# EAGLE design circuit (EAGLE 9.6.2)
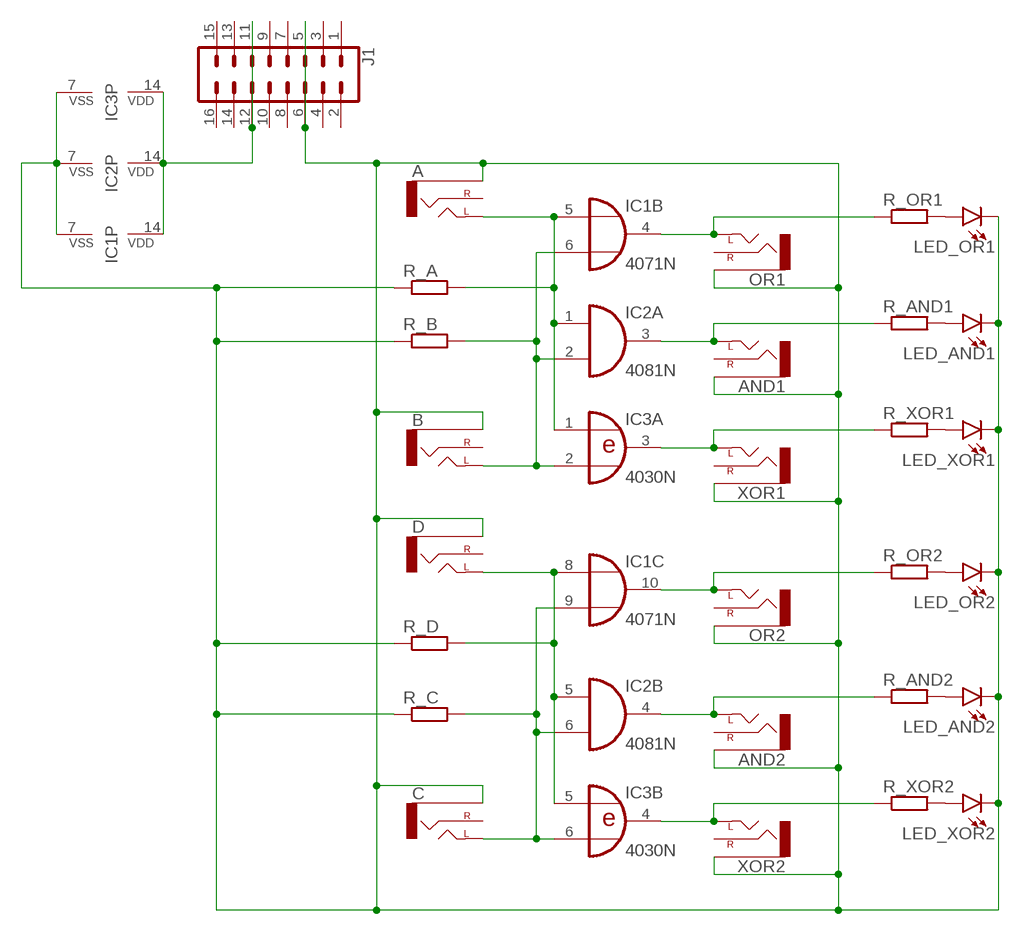
[diagram p0: schematic, sheet 1]

## Parts
A  THONKI-STEREO  [WQP-PJ366ST_JACK]
AND1  THONKI-STEREO  [WQP-PJ366ST_JACK]
AND2  THONKI-STEREO  [WQP-PJ366ST_JACK]
B  THONKI-STEREO  [WQP-PJ366ST_JACK]
C  THONKI-STEREO  [WQP-PJ366ST_JACK]
D  THONKI-STEREO  [WQP-PJ366ST_JACK]
IC1  4071N  [DIL14]
IC2  4081N  [DIL14]
IC3  4030N  [DIL14]
J1  CONN_08X2  [2X8]
LED_AND1  LED3MM  [LED_3MM]
LED_AND2  LED3MM  [LED_3MM]
LED_OR1  LED3MM  [LED_3MM]
LED_OR2  LED3MM  [LED_3MM]
LED_XOR1  LED3MM  [LED_3MM]
LED_XOR2  LED3MM  [LED_3MM]
OR1  THONKI-STEREO  [WQP-PJ366ST_JACK]
OR2  THONKI-STEREO  [WQP-PJ366ST_JACK]
R_A  RESISTOR7MM  [7MM_RESISTOR]
R_AND1  RESISTOR7MM  [7MM_RESISTOR]
R_AND2  RESISTOR7MM  [7MM_RESISTOR]
R_B  RESISTOR7MM  [7MM_RESISTOR]
R_C  RESISTOR7MM  [7MM_RESISTOR]
R_D  RESISTOR7MM  [7MM_RESISTOR]
R_OR1  RESISTOR7MM  [7MM_RESISTOR]
R_OR2  RESISTOR7MM  [7MM_RESISTOR]
R_XOR1  RESISTOR7MM  [7MM_RESISTOR]
R_XOR2  RESISTOR7MM  [7MM_RESISTOR]
XOR1  THONKI-STEREO  [WQP-PJ366ST_JACK]
XOR2  THONKI-STEREO  [WQP-PJ366ST_JACK]

## Nets
LED_OR1: A.P$3_SLEEVE(SLEEVE) AND1.P$3_SLEEVE(SLEEVE) AND2.P$3_SLEEVE(SLEEVE) B.P$3_SLEEVE(SLEEVE) C.P$3_SLEEVE(SLEEVE) D.P$3_SLEEVE(SLEEVE) IC1.7(P:VSS) IC2.7(P:VSS) IC3.7(P:VSS) J1.5 J1.6 LED_AND1.K(C) LED_AND2.K(C) LED_OR1.K(C) LED_OR2.K(C) LED_XOR1.K(C) LED_XOR2.K(C) OR1.P$3_SLEEVE(SLEEVE) OR2.P$3_SLEEVE(SLEEVE) R_A.1 R_B.1 R_C.1 R_D.1 XOR1.P$3_SLEEVE(SLEEVE) XOR2.P$3_SLEEVE(SLEEVE)
N$2: LED_OR1.A R_OR1.2
N$8: LED_AND1.A R_AND1.2
N$9: IC1.14(P:VDD) IC2.14(P:VDD) IC3.14(P:VDD) J1.11 J1.12
N$10: LED_XOR1.A R_XOR1.2
N$11: LED_OR2.A R_OR2.2
N$12: LED_AND2.A R_AND2.2
N$13: LED_XOR2.A R_XOR2.2
N$14: IC3.4(B:O) R_XOR2.1 XOR2.P$1_TIP(LEFT)
N$16: AND2.P$1_TIP(LEFT) IC2.4(B:O) R_AND2.1
N$18: IC1.10(C:O) OR2.P$1_TIP(LEFT) R_OR2.1
N$19: IC3.3(A:O) R_XOR1.1 XOR1.P$1_TIP(LEFT)
N$20: AND1.P$1_TIP(LEFT) IC2.3(A:O) R_AND1.1
N$21: IC1.4(B:O) OR1.P$1_TIP(LEFT) R_OR1.1
N$22: A.P$1_TIP(LEFT) IC1.5(B:I0) IC2.1(A:I0) IC3.1(A:I0) R_A.2
N$23: B.P$1_TIP(LEFT) IC1.6(B:I1) IC2.2(A:I1) IC3.2(A:I1) R_B.2
N$26: D.P$1_TIP(LEFT) IC1.8(C:I0) IC2.5(B:I0) IC3.5(B:I0) R_D.2
N$27: C.P$1_TIP(LEFT) IC1.9(C:I1) IC2.6(B:I1) IC3.6(B:I1) R_C.2
Unconnected: A.P$2_SWITCH(RIGHT) AND1.P$2_SWITCH(RIGHT) AND2.P$2_SWITCH(RIGHT) B.P$2_SWITCH(RIGHT) C.P$2_SWITCH(RIGHT) D.P$2_SWITCH(RIGHT) IC1.1(A:I0) IC1.2(A:I1) IC1.3(A:O) IC1.11(D:O) IC1.12(D:I0) IC1.13(D:I1) IC2.8(C:I0) IC2.9(C:I1) IC2.10(C:O) IC2.11(D:O) IC2.12(D:I0) IC2.13(D:I1) IC3.8(C:I0) IC3.9(C:I1) IC3.10(C:O) IC3.11(D:O) IC3.12(D:I0) IC3.13(D:I1) J1.1 J1.2 J1.3 J1.4 J1.7 J1.8 J1.9 J1.10 J1.13 J1.14 J1.15 J1.16 OR1.P$2_SWITCH(RIGHT) OR2.P$2_SWITCH(RIGHT) XOR1.P$2_SWITCH(RIGHT) XOR2.P$2_SWITCH(RIGHT)

## Library data of the parts
A AND1 AND2 B C D OR1 OR2 XOR1 XOR2 = MusicThingModular:THONKI-STEREO: 3.5mm socket for Eurorack modular synths
IC1 = 40xx:4071: Quad 2-input OR
IC2 = 40xx:4081: Quad 2-input AND
IC3 = 40xx:4030: Quad XOR
J1 = SparkFun-Connectors:CONN_08X2: Multi connection point. Often used as Generic Header-pin footprint for 0.1 inch spaced/style header connections You can populate with any combo of single row headers, but if you'd like an exact match, check this: Header - 2x8 (Male, 0.1") <https://www.sparkfun.com/products/13156> (PRT-13156) On any of the 0.1 inch spaced packages, you can populate with these: Break Away Headers - Straight <https://www.sparkfun.com/products/116> (PRT-00116) Break Away Male Headers - Right Angle <https://www.sparkfun.com/products/553> (PRT-00553) Female Headers <https://www.sparkfun.com/products/115> (PRT-00115) Break Away Headers - Machine Pin <https://www.sparkfun.com/products/117> (PRT-00117) Break Away Female Headers - Swiss Machine Pin <https://www.sparkfun.com/products/743> (PRT-00743)
LED_AND1 LED_AND2 LED_OR1 LED_OR2 LED_XOR1 LED_XOR2 = SparkFun-LED:LED: LED (Generic) Standard schematic elements and footprints for 5mm, 3mm, 1206, and 0603 sized LEDs. Generic LEDs with no color specified.; PROD_ID: DIO-08794
R_A R_AND1 R_AND2 R_B R_C R_D R_OR1 R_OR2 R_XOR1 R_XOR2 = MusicThingModular:RESISTOR: Standard resistor, various versions

## Board
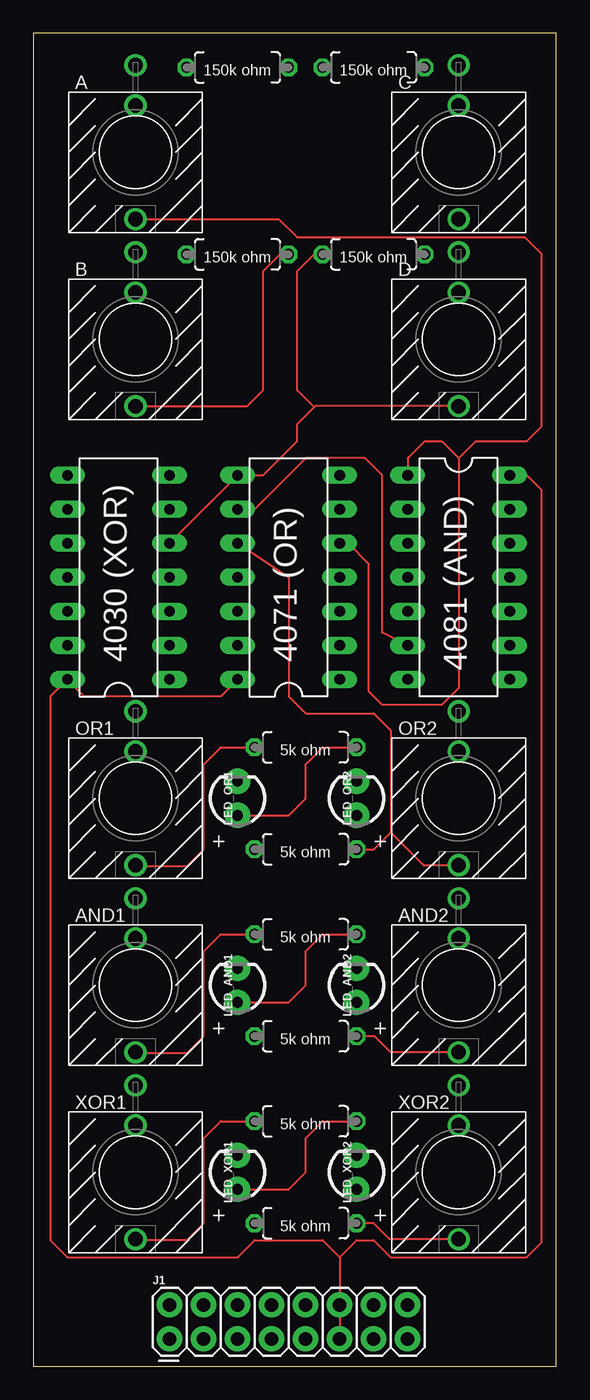
[diagram p1: board, top side]
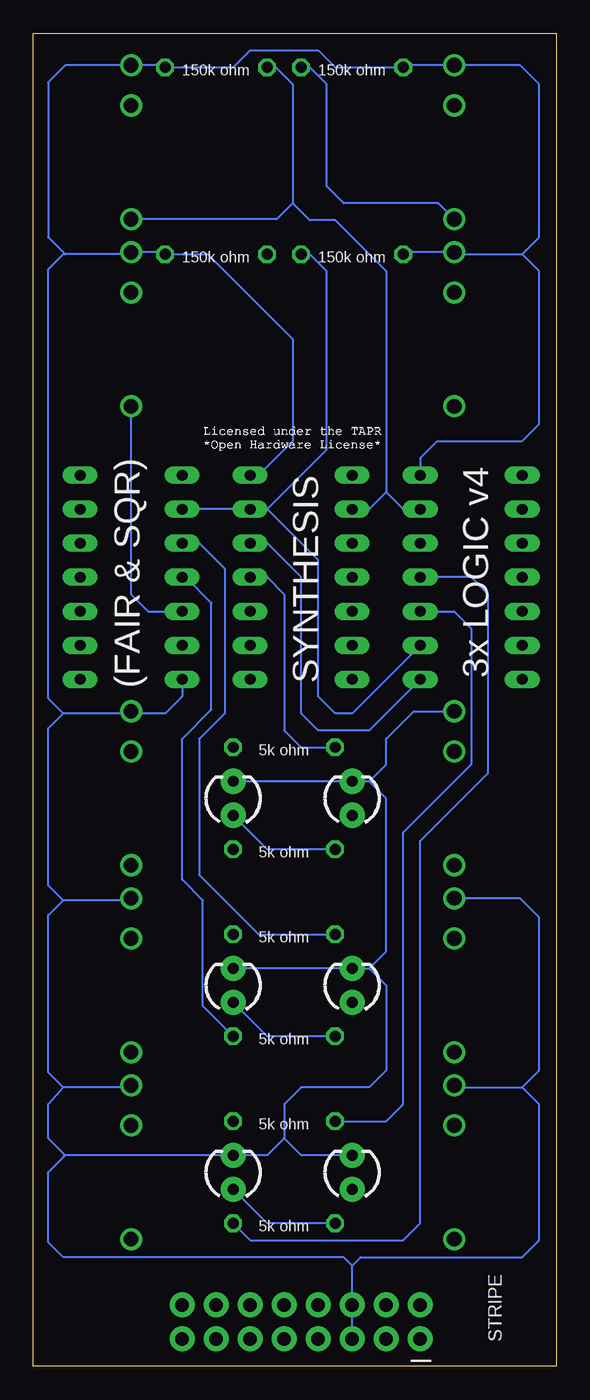
[diagram p2: board, bottom side, seen from below]

Size 39.04 x 99.56 mm. Coordinates in mm from the lower left corner, seen from the top.
Outline: 0,0 39.04,0 39.04,99.56 0,99.56 0,0
Copper layers (1*16): Top 0.035mm / dielectric 1.5mm / Bottom 0.035mm
Design rules "default": minimum track width 6mil, minimum drill 0.35mm, track to track 6mil, track to pad 6mil, pad to pad 6mil, via to via 6mil, smd to smd 6mil, copper to edge 40mil, drill to drill 6mil, minimum pad ring 10mil, minimum via ring 8mil, stop-mask expansion 4mil, vias tented up to drill 0mil, thermal gap 10mil

### Footprints (pad centres in the part's own frame; a part is rotated, then mirrored left to right if it is on the bottom)
WQP-PJ366ST_JACK = drill 1.1: P$1_TIP 0,5; P$2_SWITCH 0,-3.5; P$3_SLEEVE 0,-6.5
DIL14 = drill 0.813 long: 1 -7.62,-3.81; 2 -5.08,-3.81; 3 -2.54,-3.81; 4 0,-3.81; 5 2.54,-3.81; 6 5.08,-3.81; 7 7.62,-3.81; 8 7.62,3.81; 9 5.08,3.81; 10 2.54,3.81; 11 0,3.81; 12 -2.54,3.81; 13 -5.08,3.81; 14 -7.62,3.81
2X8 = drill 1.016 pad 1.88: 1 0,0; 2 0,2.54; 3 2.54,0; 4 2.54,2.54; 5 5.08,0; 6 5.08,2.54; 7 7.62,0; 8 7.62,2.54; 9 10.16,0; 10 10.16,2.54; 11 12.7,0; 12 12.7,2.54; 13 15.24,0; 14 15.24,2.54; 15 17.78,0; 16 17.78,2.54
LED_3MM = drill 0.813 pad 1.88: A -1.27,0; K 1.27,0
7MM_RESISTOR = drill 0.813 octagon: 1 -3.81,0; 2 3.81,0

### Placement (x,y rotation side)
A  7.62,90.68 180 top
AND1  7.62,28.45 180 top
AND2  31.75,28.45 180 top
B  7.62,76.71 180 top
C  31.75,90.68 180 top
D  31.75,76.71 180 top
IC1  19.05,58.93 90 top
IC2  31.75,58.93 270 top
IC3  6.35,58.93 90 top
J1  10.16,2.03 0 top
LED_AND1  15.24,28.45 90 top
LED_AND2  24.13,28.45 90 top
LED_OR1  15.24,42.42 90 top
LED_OR2  24.13,42.42 90 top
LED_XOR1  15.24,14.48 90 top
LED_XOR2  24.13,14.48 90 top
OR1  7.62,42.42 180 top
OR2  31.75,42.42 180 top
R_A  15.24,97.03 0 top
R_AND1  20.32,32.26 0 top
R_AND2  20.32,24.64 180 top
R_B  15.24,83.06 0 top
R_C  25.4,97.03 180 top
R_D  25.4,83.06 180 top
R_OR1  20.32,46.23 0 top
R_OR2  20.32,38.61 180 top
R_XOR1  20.32,18.29 0 top
R_XOR2  20.32,10.67 180 top
XOR1  7.62,14.48 180 top
XOR2  31.75,14.48 180 top

### Tracks (layer width: path | path; a pad name or v marks a point on that pad's centre or on a via)
LED_OR1
  Bottom 0.152: 2.54,83.06 7.47,83.06 B.P$3_SLEEVE 11.28,83.21 R_B.1 | 2.54,83.06 1.27,84.33 1.27,95.76 2.69,97.18 A.P$3_SLEEVE 11.28,97.18 R_A.1 16.51,97.03 17.78,98.3 22.86,98.3 24.13,97.03 R_C.1 29.36,97.18 C.P$3_SLEEVE 36.68,97.18 37.95,95.91 37.95,84.33 36.75,83.13 | XOR1.P$3_SLEEVE 7.47,20.83 2.54,20.83 | 2.54,20.83 1.27,22.1 1.27,33.53 2.69,34.95 AND1.P$3_SLEEVE | 2.54,83.06 1.27,81.79 1.27,70.36 2.54,69.09 8.89,69.09 10.16,67.82 IC3.7 | J1.5 J1.6 15.24,7.49 | LED_XOR1.K 19.05,15.75 20.32,17.02 | LED_AND2.K LED_AND1.K 13.97,29.72 | LED_OR2.K LED_OR1.K 13.97,43.69 | 36.83,48.77 37.95,49.89 37.95,81.94 36.75,83.13 | AND2.P$3_SLEEVE 31.9,34.8 36.83,34.8 | 36.83,34.8 37.95,35.92 37.95,47.65 36.83,48.77 | XOR2.P$3_SLEEVE 31.9,20.83 36.83,20.83 | 36.83,20.83 37.95,21.95 37.95,33.68 36.83,34.8 | 2.54,20.83 1.27,19.56 1.27,9.4 2.54,8.13 14.61,8.13 15.24,7.49 | 36.83,20.83 37.95,19.56 37.95,17.02 36.75,15.82 36.75,15.67 | IC2.7 27.94,50.04 29.21,48.77 31.75,48.77 | 31.75,48.77 36.83,48.77 | OR2.P$3_SLEEVE 31.75,48.77 | 13.97,29.72 12.7,28.45 12.7,22.1 13.97,20.83 19.05,20.83 20.32,19.56 20.32,17.02 | 20.32,17.02 21.59,15.75 LED_XOR2.K 36.68,15.75 36.75,15.67 | 13.97,29.72 12.7,30.99 12.7,42.42 13.97,43.69 | 13.97,43.69 12.7,44.96 12.7,46.86 10.64,48.92 OR1.P$3_SLEEVE | 15.24,7.49 15.88,8.13 36.83,8.13 37.95,9.25 37.95,14.48 36.75,15.67 | IC1.7 22.23,66.55 19.68,69.09 19.68,76.71 26.04,83.06 R_D.1 29.36,83.21 D.P$3_SLEEVE 31.9,83.06 36.68,83.06 36.75,83.13
N$2
  Top 0.152: LED_OR1.A 19.05,41.15 20.32,42.42 20.32,44.96 21.59,46.23 R_OR1.2
N$8
  Top 0.152: LED_AND1.A 19.05,27.18 20.32,28.45 20.32,30.99 21.59,32.26 R_AND1.2
N$9
  Top 0.152: IC2.14 36.83,66.55 37.95,65.43 37.95,9.25 36.83,8.13 26.67,8.13 25.4,9.4 24.13,9.4 22.86,8.13 | 22.86,8.13 J1.12 J1.11 | 22.86,8.13 21.59,9.4 16.51,9.4 15.24,8.13 2.54,8.13 1.27,9.4 1.27,50.04 IC3.14 3.81,50.04 13.97,50.04 IC1.14
N$10
  Top 0.152: LED_XOR1.A 19.05,13.21 20.32,14.48 20.32,17.02 21.59,18.29 R_XOR1.2
N$11
  Bottom 0.152: R_OR2.2 21.59,38.61 LED_OR2.A
N$12
  Bottom 0.152: R_AND2.2 21.59,24.64 LED_AND2.A
N$13
  Bottom 0.152: R_XOR2.2 21.59,10.67 LED_XOR2.A
N$14
  Top 0.152: XOR2.P$1_TIP 26.59,9.48 25.4,10.67 R_XOR2.1
  Bottom 0.152: R_XOR2.1 22.86,9.4 11.43,9.4 10.16,10.67 10.16,39.24 5.08,44.32 5.08,57.66 6.35,58.93 IC3.4
N$16
  Top 0.152: AND2.P$1_TIP 26.67,23.45 25.48,24.64 R_AND2.1
  Bottom 0.152: R_AND2.1 26.39,26.9 26.39,34.8 27.94,36.35 27.94,46.86 25.76,49.05 25.76,57.02 27.66,58.93 IC2.4
N$18
  Top 0.152: OR2.P$1_TIP 29.21,37.42 29.13,37.42 26.67,39.88 | IC1.10 19.05,58.93 19.05,50.04 20.32,48.77 25.4,48.77 26.67,47.5 26.67,39.88 | R_OR2.1 25.4,38.61 26.67,39.88
N$19
  Top 0.152: R_XOR1.1 13.97,18.29 12.7,17.02 12.7,10.67 11.43,9.4 7.7,9.4 XOR1.P$1_TIP
  Bottom 0.152: IC3.3 7.62,56.39 6.35,55.12 6.35,44.96 11.43,39.88 11.43,19.56 12.7,18.29 R_XOR1.1
N$20
  Top 0.152: R_AND1.1 13.97,32.26 12.7,30.99 12.7,24.64 11.43,23.37 7.7,23.37 AND1.P$1_TIP
  Bottom 0.152: IC2.3 26.67,61.47 24.77,59.56 24.77,48.77 26.67,46.86 26.67,36.7 22.23,32.26 R_AND1.1
N$21
  Top 0.152: R_OR1.1 13.97,46.23 12.7,44.96 12.7,38.61 11.43,37.34 7.7,37.34 OR1.P$1_TIP
  Bottom 0.152: IC1.4 21.59,58.93 20.32,57.66 20.32,47.5 19.05,46.23 R_OR1.1
N$22
  Top 0.152: IC2.1 27.94,67.82 29.21,69.09 30.48,69.09 31.75,67.82 | IC1.5 23.51,61.47 25.04,59.93 25.04,50.39 26.04,49.4 30.48,49.4 31.75,50.67 31.75,67.82 | 31.75,67.82 33.02,69.09 36.83,69.09 37.95,70.21 37.95,83.06 36.68,84.33 19.68,84.33 18.34,85.68 A.P$1_TIP
  Bottom 0.152: IC3.1 13.97,47.5 17.78,47.5 19.05,48.77 19.05,58.93 21.59,61.47 IC1.5 | R_A.2 18.41,97.03 17.14,95.76 17.14,88.14 15.88,86.87 8.81,86.87 A.P$1_TIP
N$23
  Top 0.152: B.P$1_TIP 15.96,71.71 17.14,72.9 17.14,81.79 18.41,83.06 R_B.2
  Bottom 0.152: IC3.2 15.24,48.77 16.51,48.77 17.78,50.04 17.78,60.2 21.59,64.01 | 21.59,64.01 IC1.6 IC2.2 | R_B.2 18.41,83.06 17.14,81.79 17.14,68.45 21.59,64.01
N$26
  Top 0.152: IC3.5 IC1.8 17.14,66.55 19.68,69.09 19.68,70.36 20.95,71.63 | R_D.2 20.95,83.06 19.68,81.79 19.68,72.9 20.95,71.63 | D.P$1_TIP 21.04,71.71 20.95,71.63
  Bottom 0.152: D.P$1_TIP 31.75,57.66 30.48,56.39 IC2.5
N$27
  Top 0.152: IC2.6 26.04,54.8 26.04,66.55 24.77,67.82 20.32,67.82 16.51,64.01 IC1.9
  Bottom 0.152: 12.7,65.28 12.7,81.79 16.51,85.6 18.41,85.6 19.68,86.87 | 12.7,65.28 11.43,64.01 IC3.6 | 12.7,65.28 13.97,64.01 IC1.9 | R_C.2 20.95,97.03 19.68,95.76 19.68,86.87 | 19.68,86.87 20.88,85.68 C.P$1_TIP

### Text on the board
tPlace: 150k ohm | 150k ohm | 150k ohm | 150k ohm | 4030 (XOR) | 4071 (OR) | 4081 (AND) | 5k ohm | + | + | 5k ohm | 5k ohm | + | + | 5k ohm | 5k ohm | + | 5k ohm | +
bPlace: 150k ohm | 150k ohm | 150k ohm | 150k ohm | 3x LOGIC v4 | (FAIR & SQR) | SYNTHESIS | 5k ohm | 5k ohm | 5k ohm | 5k ohm | 5k ohm | 5k ohm
bNames: STRIPE